# EAGLE design M_E_ext_sensor (EAGLE 9.6.2)
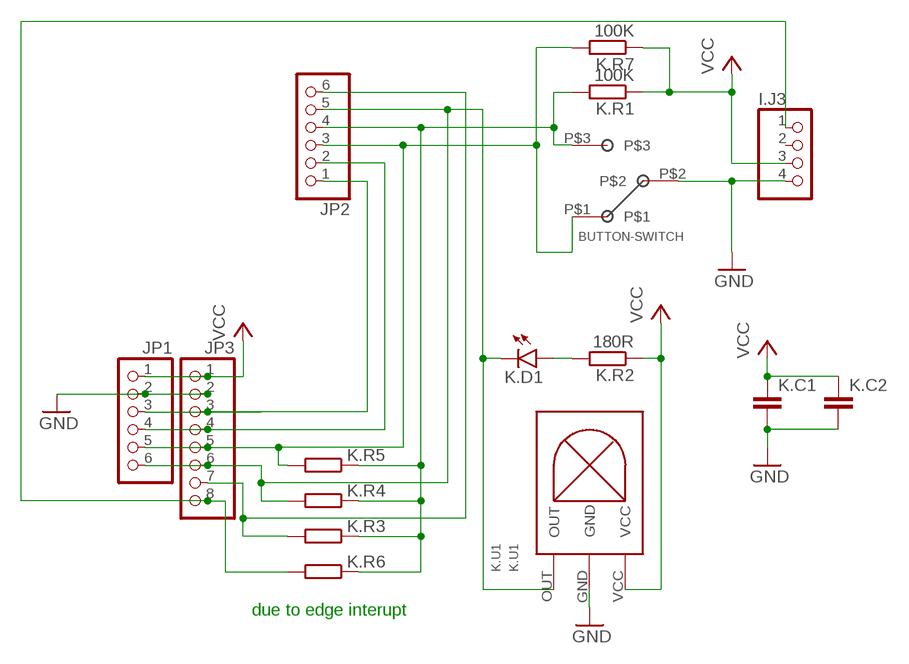
[diagram p0: schematic, sheet 1]

## Parts
I.J3  PINHD-1X4  [1X04]
JP1  PINHD-1X6  [1X06]
JP2  PINHD-1X6  [1X06]
JP3  PINHD-1X8  [1X08]
K.C1  C-EUC0603  [C0603]
K.C2  C-EUC0603  [C0603]
K.D1  LEDCHIP-LED0603  [CHIP-LED0603]
K.R1  100K  R-EU_R0603  [R0603]
K.R2  180R  R-EU_R0603  [R0603]
K.R3  0R  R-EU_R0603  [R0603]
K.R4  0R  R-EU_R0603  [R0603]
K.R5  0R  R-EU_R0603  [R0603]
K.R6  0R  R-EU_R0603  [R0603]
K.R7  100K  R-EU_R0603  [R0603]
K.U1  VS1838B  [IR_RECEIVER]
U$2  BUTTON-SWITCH  [BUTTON-SWITCH]

## Nets
GND: I.J3.4 JP1.2 JP3.2 K.C1.2 K.C2.2 K.U1.GND U$2.P$2
N$2: JP2.4 K.R1.2 K.R3.1 K.R4.1 K.R5.1 K.R6.1 U$2.P$3
N$3: JP1.5 JP2.3 JP3.5 K.R5.2 K.R7.2 U$2.P$1
N$4: JP1.4 JP2.2 JP3.4
N$5: JP1.3 JP2.1 JP3.3
N$6: K.D1.A1(A) K.R2.2
N$7: JP2.6 JP3.7 K.R3.2
N$9: I.J3.1 JP3.8 K.R6.2
N$10: JP1.6 JP2.5 JP3.6 K.D1.C1(C) K.R4.2 K.U1.OUT
VCC: I.J3.3 JP1.1 JP3.1 K.C1.1 K.C2.1 K.R1.1 K.R2.1 K.R7.1 K.U1.VCC
Unconnected: I.J3.2

## Notes on the sheet
- due to edge interupt

## Library data of the parts
I.J3 = pinhead2:PINHD-1X4: PIN HEADER
JP1 JP2 = pinhead2:PINHD-1X6: PIN HEADER
JP3 = pinhead2:PINHD-1X8: PIN HEADER
K.C1 K.C2 = rcl:C-EU: CAPACITOR, European symbol; SPICEPREFIX: C
K.D1 = led:LED: LED OSRAM: - CHIPLED LG R971, LG N971, LY N971, LG Q971, LY Q971, LO R971, LY R971 LH N974, LH R974 LS Q976, LO Q976, LY Q976 LO Q996 - Hyper CHIPLED LW Q18S LB Q993, LB Q99A, LB R99A - SideLED LS A670, LO A670, LY A670, LG A670, LP A670 LB A673, LV A673, LT A673, LW A673 LH A674 LY A675 LS A676, LA A676, LO A676, LY A676, LW A676 LS A679, LY A679, LG A679 - Hyper Micro SIDELED® LS Y876, LA Y876, LO Y876, LY Y876 LT Y87S - SmartLED LW L88C, LW L88S LB L89C, LB L89S, LG L890 LS L89K, LO L89K, LY L89K LS L896, LA L896, LO L896, LY L896 - TOPLED LS T670, LO T670, LY T670, LG T670, LP T670 LSG T670, LSP T670, LSY T670, LOP T670, LYG T670 LG T671, LOG T671, LSG T671 LB T673, LV T673, LT T673, LW T673 LH T674 LS T676, LA T676, LO T676, LY T676, LB T676, LH T676, LSB T676, LW T676 LB T67C, LV T67C, LT T67C, LS T67K, LO T67K, LY T67K, LW E67C LS E67B, LA E67B, LO E67B, LY E67B, LB E67C, LV E67C, LT E67C LW T67C LS T679, LY T679, LG T679 LS T770, LO T770, LY T770, LG T770, LP T770 LB T773, LV T773, LT T773, LW T773 LH T774 LS E675, LA E675, LY E675, LS T675 LS T776, LA T776, LO T776, LY T776, LB T776 LHGB T686 LT T68C, LB T68C - Hyper Mini TOPLED® LB M676 - Mini TOPLED Santana® LG M470 LS M47K, LO M47K, LY M47K Source: http://www.osram.convergy.de LUXEON: - LUMILED® LXK2-PW12-R00, LXK2-PW12-S00, LXK2-PW14-U00, LXK2-PW14-V00 LXK2-PM12-R00, LXK2-PM12-S00, LXK2-PM14-U00 LXK2-PE12-Q00, LXK2-PE12-R00, LXK2-PE12-S00, LXK2-PE14-T00, LXK2-PE14-U00 LXK2-PB12-K00, LXK2-PB12-L00, LXK2-PB12-M00, LXK2-PB14-N00, LXK2-PB14-P00, LXK2-PB14-Q00 LXK2-PR12-L00, LXK2-PR12-M00, LXK2-PR14-Q00, LXK2-PR14-R00 LXK2-PD12-Q00, LXK2-PD12-R00, LXK2-PD12-S00 LXK2-PH12-R00, LXK2-PH12-S00 LXK2-PL12-P00, LXK2-PL12-Q00, LXK2-PL12-R00 Source: www.luxeon.com KINGBRIGHT: KA-3528ASYC Source: www.kingbright.com
K.R1-K.R7 = rcl:R-EU_: RESISTOR, European symbol; SPICEPREFIX: R
K.U1 = hugo:VS1838B
U$2 = hugo:BUTTON-SWITCH

## Board
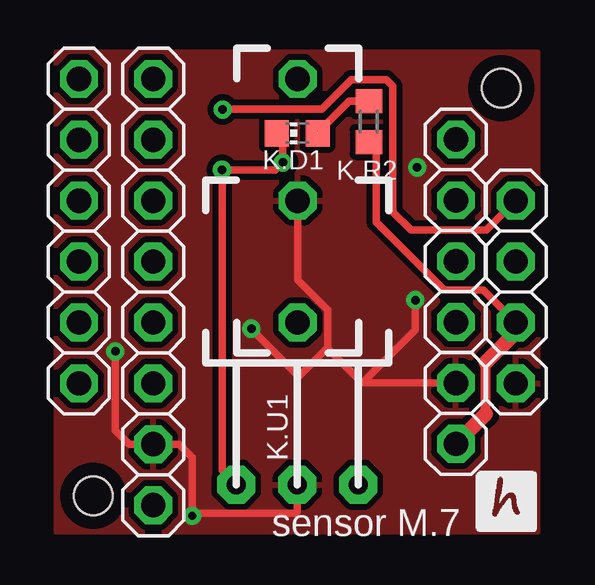
[diagram p1: board, top side]
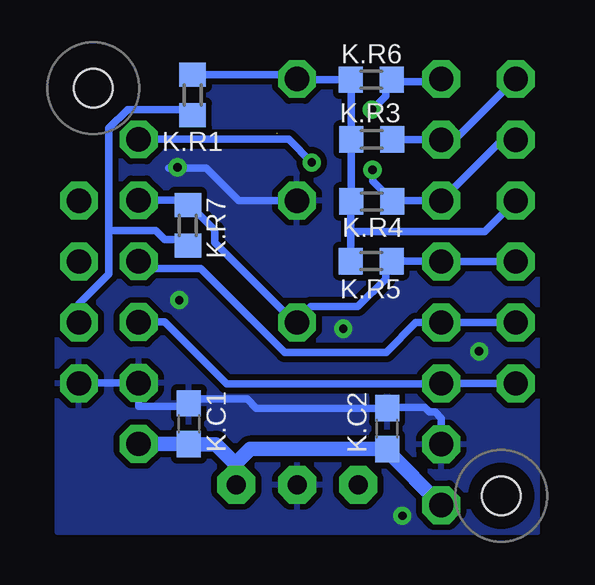
[diagram p2: board, bottom side, seen from below]

No outline drawn. Coordinates in mm, seen from the top.
Copper layers (1*16): Top 0.035mm / dielectric 1.5mm / Bottom 0.035mm
Design rules "default *": minimum track width 12mil, minimum drill 0.35mm, track to track 10mil, track to pad 10mil, pad to pad 10mil, via to via 10mil, smd to smd 10mil, copper to edge 15mil, drill to drill 15mil, minimum pad ring 10mil, minimum via ring 8mil, stop-mask expansion 4mil, vias tented up to drill 0mil, thermal gap 10mil
Holes 1.6 mm at 19,19 2,2
tRestrict: area 18,18 to 20,20; area 1,1 to 3,3
bRestrict: area 1,1 to 3,3; area 18,18 to 20,20

### Footprints (pad centres in the part's own frame; a part is rotated, then mirrored left to right if it is on the bottom)
1X04 = drill 1.016 pad 1.575 octagon: 1 -3.81,0; 2 -1.27,0; 3 1.27,0; 4 3.81,0
1X06 = drill 1.016 pad 1.575 octagon: 1 -6.35,0; 2 -3.81,0; 3 -1.27,0; 4 1.27,0; 5 3.81,0; 6 6.35,0
1X08 = drill 1.016 pad 1.575 octagon: 1 -8.89,0; 2 -6.35,0; 3 -3.81,0; 4 -1.27,0; 5 1.27,0; 6 3.81,0; 7 6.35,0; 8 8.89,0
C0603 = smd 1.1 x 1: 1 -0.85,0; 2 0.85,0
CHIP-LED0603 = smd 1.1 x 1: A1 0,-0.85; C1 0,0.85
R0603 = smd 1 x 1.1: 1 -0.85,0; 2 0.85,0
IR_RECEIVER = drill 0.8 pad 1.575 octagon: GND 0,0; OUT -2.54,0; VCC 2.54,0
BUTTON-SWITCH = drill 1.016 pad 1.575 octagon: P$1 0,0; P$2 5.08,0; P$3 10.16,0

### Placement (x,y rotation side)
I.J3  19.6,10.5 270 top
JP1  17.11,10.52 90 top
JP2  1.4,13.04 90 top
JP3  4.5,10.5 90 top
K.C1  15.01,5 90 bottom
K.C2  6.76,4.8 90 bottom
K.D1  10.5,17.12 90 top
K.R1  14.86,18.72 90 bottom
K.R2  13.48,17.6 90 top
K.R3  7.4,16.87 0 bottom
K.R4  7.4,14.27 0 bottom
K.R5  7.42,11.79 0 bottom
K.R6  7.42,19.35 0 bottom
K.R7  15.06,13.28 90 bottom
K.U1  10.5,2.46 0 top
U$2  10.52,9.23 90 top

### Tracks (layer width: path | path; a pad name or v marks a point on that pad's centre or on a via)
GND  (via drill 0.35)
  Top 0.305: U$2.P$2 10.52,10.99 11.76,9.75 11.76,8.17 11.75,8.16 | 11.75,8.16 10.5,6.91 | 10.5,6.91 K.U1.GND 10.5,1.36 10.41,1.27 6.22,1.27 v6.12,1.17 6.12,3.61 5.58,4.15 JP3.2 3.5,4.15 2.92,4.72 v2.92,8.03 | JP1.2 13.21,6.71 | 13.21,6.71 11.75,8.16 | v8.59,8.97 10.5,7.05 10.5,6.91 | 13.21,6.71 15.42,8.91 v15.42,10.16
  Bottom 0.305: 17.13,6.69 JP1.2 | JP1.2 17.11,5.73 15.14,5.73 K.C1.2 14.84,6.03 12.6,6.03 12.21,5.65 K.C2.2 6.72,5.69 5.19,5.69 4.99,5.5 4.76,5.5 4.5,5.24 JP3.2 | JP1.2 19.58,6.71 I.J3.4 | U$2.P$2 12.93,14.31 14.29,15.67 15.85,15.67
  other vias: 15.49,15.7
  pour Top (isolate 0.254): 0.47,20.5 20.5,20.5 20.5,0.5 0.47,0.5
  pour Bottom (isolate 0.254): 0.5,20.5 20.5,20.5 20.5,0.5 0.5,0.5
N$2
  Bottom 0.305: K.R1.2 10.7,19.57 U$2.P$3 10.48,19.36 K.R6.1 8.25,19.34 K.R3.1 K.R4.1 8.27,14.26 8.27,13.02 | K.R5.1 8.27,13.02 | 8.27,13.02 2.69,13.02 JP2.4
N$3
  Bottom 0.305: JP2.3 JP3.5 4.52,11.79 K.R5.2 6.82,11.53 6.82,11.05 7.98,9.89 9.94,9.89 10.52,9.32 U$2.P$1 10.62,9.23 13.94,12.55 13.94,13.09 14.81,13.96 14.88,13.96 K.R7.2 15.25,14.33 JP1.5
N$4
  Bottom 0.305: JP2.2 JP3.4 5.55,9.23 6.8,7.99 11.03,7.99 14.53,11.48 16.8,11.48 JP1.4
N$5
  Bottom 0.305: JP2.1 JP3.3 4.53,6.67 13.44,6.67 16.02,9.25 JP1.3
N$6  (1 unrouted)
  Top 0.305: K.R2.2 12.67,18.45 K.D1.A1
N$7
  Bottom 0.305: JP2.6 3.94,16.85 JP3.7 6.53,16.85 K.R3.2
N$9  (via drill 0.35)
  Top 0.305: v7.39,18.11 v7.4,18.12 11.52,18.12 12.76,19.36 14.2,19.36 14.48,19.08 14.48,13.84 15.24,13.08 18.37,13.08 I.J3.1
  Bottom 0.305: JP3.8 4.61,19.28 6.49,19.28 K.R6.2 6.82,19.1 6.82,18.67 v7.38,18.11 v7.39,18.11
N$10  (via drill 0.35)
  Top 0.305: K.U1.OUT 7.36,3.06 v7.36,15.59 9.59,15.59 v9.9,15.9 9.9,16.97
  Top 0.508: K.D1.C1 9.75,17.12 9.9,16.97
  Bottom 0.305: JP2.5 1.96,16.85 JP3.6 6.51,14.31 K.R4.2 6.55,14.32 7.36,15.13 v7.36,15.59 | v9.9,15.9 10.86,16.87 JP1.6
VCC
  Top 0.305: I.J3.3 18.24,10.59 16.62,10.59 13.79,13.42 13.79,16.55 13.59,16.75 K.R2.1
  Top 0.406: 18.36,5.41 18.36,7.56
  Top 0.61: JP1.1 18.36,5.41 | I.J3.3 19.6,8.81 18.36,7.56
  Bottom 0.305: K.U1.VCC 13.04,3.3 | I.J3.3 19.6,10.01 18.36,11.26 18.36,13.06 | 18.36,13.06 18.36,17.33 17.57,18.11 15.1,18.11 K.R1.1 | K.R7.1 15.32,12.69 16.03,12.69 16.39,13.06 18.36,13.06 | 6.76,3.87 K.C2.1
  Bottom 0.61: 13.04,3.3 13.89,4.15 K.C1.1 15.03,4.17 JP1.1 | JP3.1 6.76,3.87 | K.C2.1 12.47,3.95 13.04,3.38 K.U1.VCC

### Text on the board
tPlace: sensor M.7